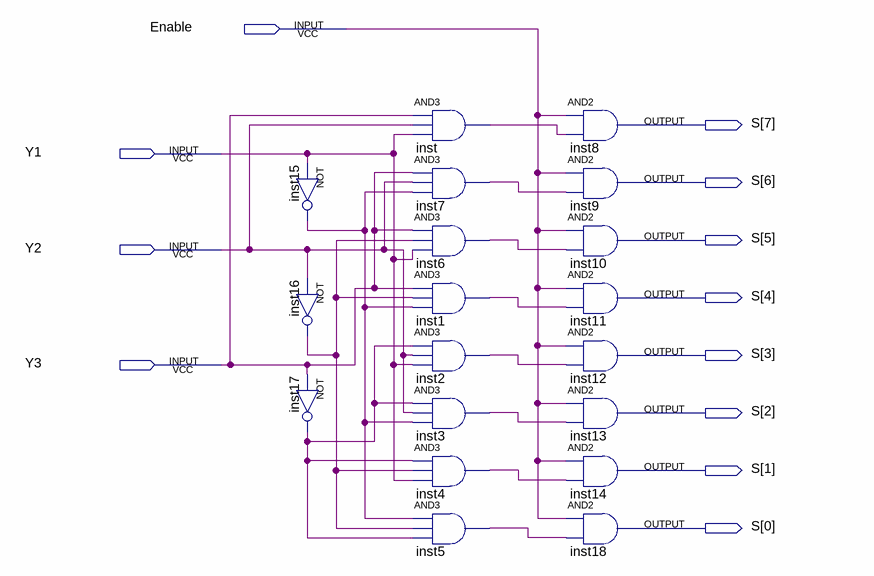
[diagram p0: schematic sheet]
// Quartus schematic Mux3-8.bdf as structural Verilog: 19 symbols, 12 pins
module \Mux3-8  (
  input  Enable,
  input  Y1,
  input  Y2,
  input  Y3,
  output [7:0] S
);

  wire inst1_out, inst2_out, inst3_out, inst4_out, inst5_out, inst6_out, inst7_out, inst15_out, inst16_out,
       inst17_out, inst_out;

  not inst15 (inst15_out, Y1);
  not inst16 (inst16_out, Y2);
  not inst17 (inst17_out, Y3);
  and inst (inst_out, Y3, Y2, Y1);
  and inst7 (inst7_out, Y3, Y2, inst15_out);
  and inst6 (inst6_out, Y3, inst16_out, Y1);
  and inst1 (inst1_out, Y3, inst16_out, inst15_out);
  and inst2 (inst2_out, inst17_out, Y2, Y1);
  and inst3 (inst3_out, inst17_out, Y2, inst15_out);
  and inst4 (inst4_out, inst17_out, inst16_out, Y1);
  and inst5 (inst5_out, inst15_out, inst16_out, inst17_out);
  and inst8 (S[7], Enable, inst_out);
  and inst9 (S[6], Enable, inst7_out);
  and inst10 (S[5], Enable, inst6_out);
  and inst11 (S[4], Enable, inst1_out);
  and inst12 (S[3], Enable, inst2_out);
  and inst13 (S[2], Enable, inst3_out);
  and inst14 (S[1], Enable, inst4_out);
  and inst18 (S[0], Enable, inst5_out);
endmodule
